# EAGLE design driver (EAGLE 7.2.0)
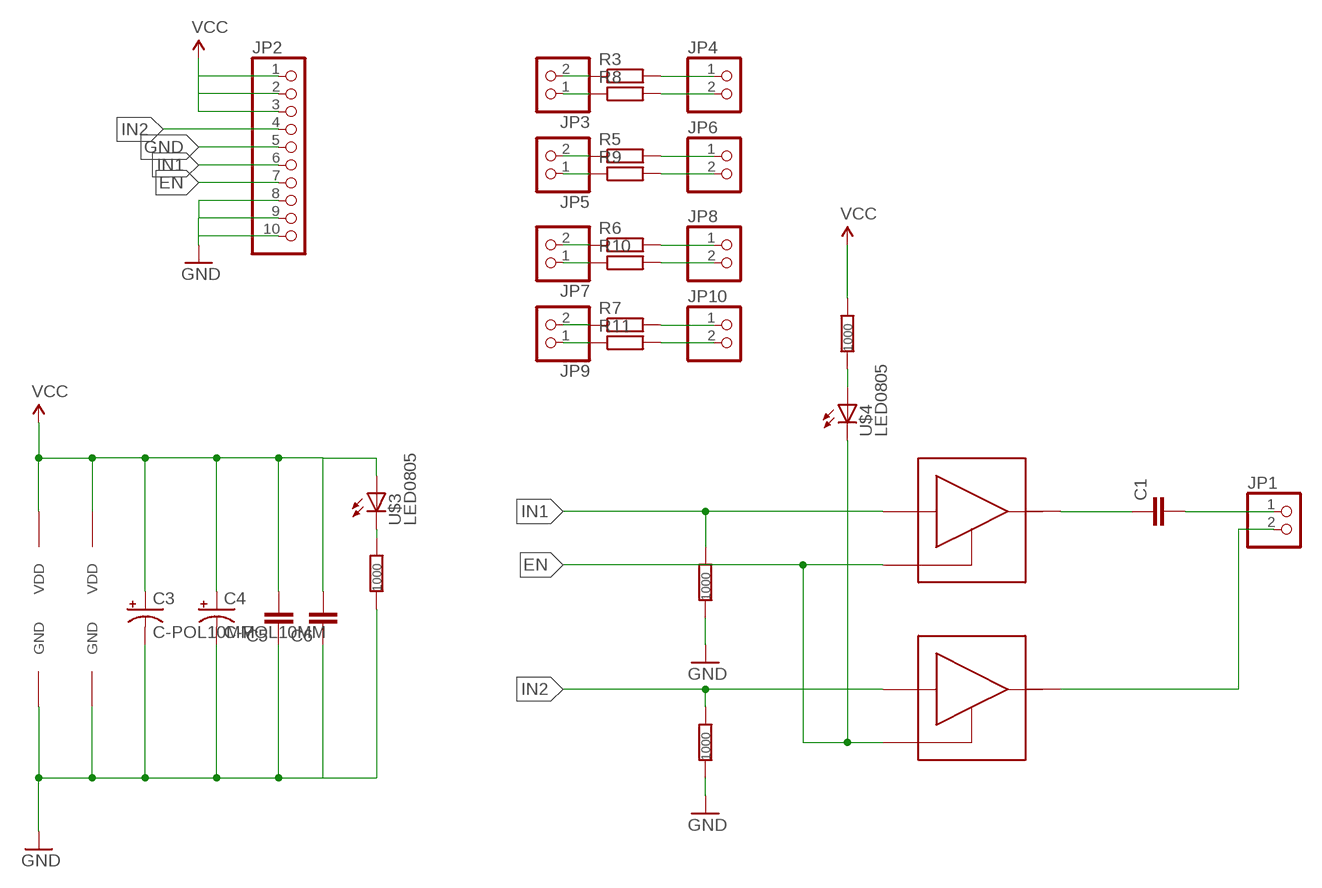
[diagram p0: schematic, sheet 1]

## Parts
C1  CC2220K  [C2220K]
C3  C-POL10MM  [PCAP10]
C4  C-POL10MM  [PCAP10]
C5  CC2220K  [C2220K]
C6  CC2220K  [C2220K]
JP1  PINHD-1X2  [1X02]
JP2  PINHD-1X10  [1X10]
JP3  PINHD-1X2  [1X02]
JP4  PINHD-1X2  [1X02]
JP5  PINHD-1X2  [1X02]
JP6  PINHD-1X2  [1X02]
JP7  PINHD-1X2  [1X02]
JP8  PINHD-1X2  [1X02]
JP9  PINHD-1X2  [1X02]
JP10  PINHD-1X2  [1X02]
R1  1000  R0805  [R0805]
R2  1000  R0805  [R0805]
R3  R-EU_0204/7  [0204/7]
R4  1000  R0805  [R0805]
R5  R-EU_0204/7  [0204/7]
R6  R-EU_0204/7  [0204/7]
R7  R-EU_0204/7  [0204/7]
R8  R-EU_0204/7  [0204/7]
R9  R-EU_0204/7  [0204/7]
R10  R-EU_0204/7  [0204/7]
R11  R-EU_0204/7  [0204/7]
R12  1000  R0805  [R0805]
U$1  IXDD614  [DPACK-5]
U$2  IXDD614  [DPACK-5]
U$3  LED0805  [0805-LED]
U$4  LED0805  [0805-LED]

## Nets
EN: JP2.7 U$1.5(EN) U$2.5(EN) U$4.C
GND: C3.P$2(-) C4.P$2(-) C5.1 C6.1 JP2.5 JP2.8 JP2.9 JP2.10 R1.1 R2.1 R12.1 U$1.3(GND) U$1.6(GND) U$2.3(GND) U$2.6(GND)
IN1: JP2.6 R1.2 U$1.4(IN)
IN2: JP2.4 R2.2 U$2.4(IN)
N$1: JP3.2 R3.1
N$2: JP4.1 R3.2
N$3: C1.1 U$1.2(OUT)
N$4: JP4.2 R8.2
N$5: C1.2 JP1.1
N$6: JP1.2 U$2.2(OUT)
N$7: JP5.2 R5.1
N$8: JP6.1 R5.2
N$9: JP6.2 R9.2
N$10: JP7.2 R6.1
N$11: JP8.1 R6.2
N$12: JP8.2 R10.2
N$13: JP9.2 R7.1
N$14: JP10.1 R7.2
N$15: JP10.2 R11.2
N$16: JP3.1 R8.1
N$17: JP5.1 R9.1
N$18: JP7.1 R10.1
N$19: JP9.1 R11.1
N$24: R12.2 U$3.C
N$25: R4.1 U$4.A
VCC: C3.P$1(+) C4.P$1(+) C5.2 C6.2 JP2.1 JP2.2 JP2.3 R4.2 U$1.1(VDD) U$2.1(VDD) U$3.A

## Library data of the parts
C1 C5 C6 = CasaLibrary:C: Capacitor
C3 C4 = CasaLibrary:C-POL
JP1 JP3-JP10 = pinhead:PINHD-1X2: PIN HEADER
JP2 = pinhead:PINHD-1X10: PIN HEADER
R1 R2 R4 R12 = CasaLibrary:R
R3 R5-R11 = rcl:R-EU_: RESISTOR, European symbol
U$1 U$2 = CasaLibrary:IXDD614
U$3 U$4 = CasaLibrary:LED

## Board
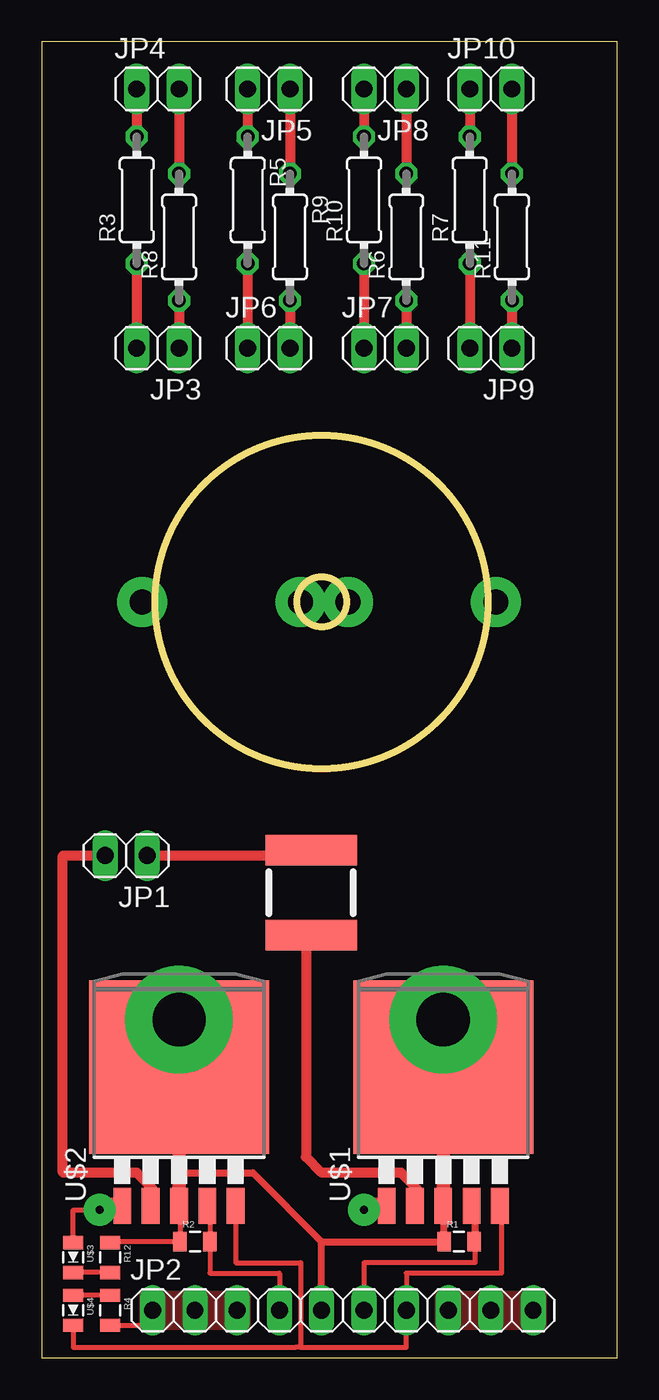
[diagram p1: board, top side]
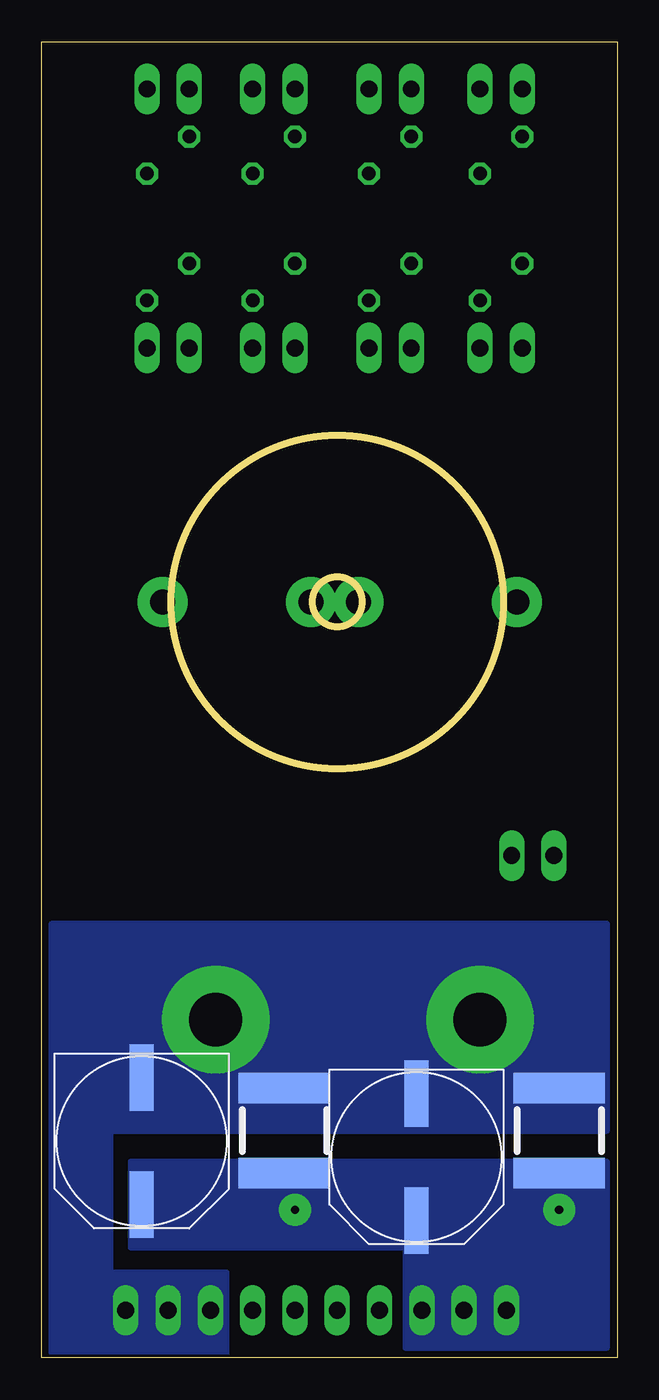
[diagram p2: board, bottom side, seen from below]

Size 34.59 x 79.05 mm. Coordinates in mm from the lower left corner, seen from the top.
Outline: 0,0 34.59,0 34.59,79.05 0,79.05 0,0
Outline: circle at 16.83,45.4 radius 10
Outline: circle at 16.83,45.4 radius 1.5
Copper layers (1*16): Top 0.035mm / dielectric 1.5mm / Bottom 0.035mm
Design rules "default": minimum track width 0.2mm, minimum drill 0.2mm, track to track 0.2mm, track to pad 0.2mm, pad to pad 0.2mm, via to via 0.2mm, smd to smd 0.2mm, copper to edge 0.2mm, drill to drill 0.2mm, minimum pad ring 10mil, minimum via ring 8mil, stop-mask expansion 4mil, vias tented up to drill 0mil, thermal gap 10mil

### Footprints (pad centres in the part's own frame; a part is rotated, then mirrored left to right if it is on the bottom)
C2220K = smd 1.85 x 5.5: 1 -2.55,0; 2 2.55,0
PCAP10 = smd 4 x 1.46: P$1 -3.81,0; P$2 3.81,0
1X02 = drill 1.016 long: 1 -1.27,0; 2 1.27,0
1X10 = drill 1.016 long: 1 -11.43,0; 2 -8.89,0; 3 -6.35,0; 4 -3.81,0; 5 -1.27,0; 6 1.27,0; 7 3.81,0; 8 6.35,0; 9 8.89,0; 10 11.43,0
R0805 = smd 0.8 x 1.2: 1 -0.9,0; 2 0.9,0
0204/7 = drill 0.813 octagon: 1 -3.81,0; 2 3.81,0
DPACK-5 = smd 1.067 x 2.159: 1 -3.404,-8.331; 2 -1.702,-8.331; 3 0,-8.331; 4 1.702,-8.331; 5 3.404,-8.331 | smd 10.8 x 10.41: 6 0,0
0805-LED = smd 0.8 x 1.2: A -0.9,0; C 0.9,0

### Placement (x,y rotation side)
C1  16.19,27.94 90 top
C3  12.06,12.06 90 bottom
C4  28.57,13.02 90 bottom
C5  3.49,13.65 270 bottom
C6  20,13.65 270 bottom
JP1  5.08,30.16 180 top
JP2  18.1,2.86 0 top
JP3  6.99,60.64 180 top
JP4  6.99,76.2 0 top
JP5  13.65,76.2 180 top
JP6  13.65,60.64 0 top
JP7  20.64,60.64 0 top
JP8  20.64,76.2 180 top
JP9  26.99,60.64 180 top
JP10  26.99,76.2 0 top
R1  25.08,6.99 0 top
R2  9.21,6.99 0 top
R3  5.71,69.53 90 top
R4  4.13,2.86 270 top
R5  12.38,69.53 270 top
R6  21.91,67.31 90 top
R7  25.72,69.53 90 top
R8  8.26,67.31 90 top
R9  14.92,67.31 270 top
R10  19.37,69.53 90 top
R11  28.26,67.31 90 top
R12  4.13,6.03 270 top
U$1  24.13,17.46 0 top
U$2  8.26,17.46 0 top
U$3  1.91,6.03 270 top
U$4  1.91,2.86 270 top

### Tracks (layer width: path | path; a pad name or v marks a point on that pad's centre or on a via)
EN
  Top 0.305: U$4.C 1.91,0.64 15.24,0.64 15.56,0.64 | 15.56,0.64 21.91,0.64 JP2.7 21.91,5.08 27.62,5.08 27.62,9.13 | U$2.5 11.66,5.71 15.56,5.71 15.56,0.64
  Top 0.406: 27.53,9.21 U$1.5 27.62,9.13
GND  (via drill 3.2 pad 6.45)
  Top 0.305: U$2.3 8.31,9.13 R2.1 4.13,6.99
  Top 0.406: 24.13,11.11 U$1.3 24.13,7.04 R1.1 | 4.13,6.99 R12.1 | JP2.5 16.83,6.99 | 16.83,6.99 24.13,6.99 | 8.26,11.11 12.7,11.11 16.83,6.99
  Top 0.813: U$1.3 v24.13,20.32 | U$2.3 8.26,11.11 v8.26,20.32
  pour Bottom (no thermals): 0.64,26.04 33.97,26.04 33.97,0.32 23.5,0.32 23.5,5.08 30.48,5.08 30.48,13.65 0.64,13.65
  pour Top (no thermals): 23.81,3.81 23.81,1.91 30.16,1.91 30.16,3.81
IN1
  Top 0.305: U$1.4 26.04,9.13 | 26.04,6.99 26.04,5.71 19.37,5.71 JP2.6
  Top 0.406: 26.04,9.13 26.04,7.04 R1.2 26.04,6.99
IN2
  Top 0.305: U$2.4 10.11,9.13 R2.2 10.11,5.08 14.29,5.08 JP2.4
  Top 0.406: U$2.4 9.84,9.13
N$1
  Top 0.61: R3.1 JP3.2
N$2
  Top 0.61: JP4.1 R3.2
N$3
  Top 0.406: U$1.2 22.54,9.13
  Top 0.61: 22.54,9.13 22.54,10.16 21.59,11.11 16.83,11.11 15.88,12.06 15.88,25.39
  Top 1.016: C1.1 15.88,25.39
N$4
  Top 0.61: JP4.2 R8.2
N$5
  Top 0.61: JP1.1 16.19,30.16
  Top 0.813: 16.19,30.16 16.83,30.16
  Top 1.016: C1.2 16.19,30.16
N$6
  Top 0.406: U$2.2 6.67,9.13
  Top 0.61: 6.67,9.13 6.67,10.16 5.71,11.11 1.27,11.11 1.27,30.16 JP1.2
N$7
  Top 0.61: JP5.2 R5.1
N$8
  Top 0.61: R5.2 JP6.1
N$9
  Top 0.61: R9.2 JP6.2
N$10
  Top 0.61: R6.1 JP7.2
N$11
  Top 0.61: JP8.1 R6.2
N$12
  Top 0.61: JP8.2 R10.2
N$13
  Top 0.61: R7.1 JP9.2
N$14
  Top 0.61: JP10.1 R7.2
N$15
  Top 0.61: JP10.2 R11.2
N$16
  Top 0.61: R8.1 JP3.1
N$17
  Top 0.61: JP5.1 R9.1
N$18
  Top 0.61: R10.1 JP7.1
N$19
  Top 0.61: R11.1 JP9.1
N$20  (via drill 1.5 pad 3)
  other vias: 15.56,45.4
N$21  (via drill 1.5 pad 3)
  other vias: 18.41,45.4
N$22  (via drill 1.5 pad 3)
  other vias: 6.03,45.4
N$23  (via drill 1.5 pad 3)
  other vias: 27.3,45.4
N$24
  Top 0.305: R12.2 U$3.C
N$25
  Top 0.305: R4.1 U$4.A
VCC  (via drill 0.5 pad 1.93)
  Top 0.305: 4.85,9.21 U$2.1 | 20.73,9.21 U$1.1 | U$3.A 1.91,8.89 v3.49,8.89 | R4.2 6.67,1.96
  Top 0.406: U$2.1 5.08,9.13 | 6.67,1.96 JP2.1
  Top 0.813: v3.49,8.89 3.49,9.21 4.85,9.21 | v19.37,8.89 19.37,9.21 20.73,9.21
  pour Bottom (no thermals): 0.64,11.75 29.21,11.75 29.21,6.67 12.7,6.67 12.7,0.64 0.64,0.64
  pour Top (no thermals): 6.03,3.81 6.03,1.91 12.38,1.91 12.38,3.81